# Altium schematic sheet MCU.SchDoc
size A4
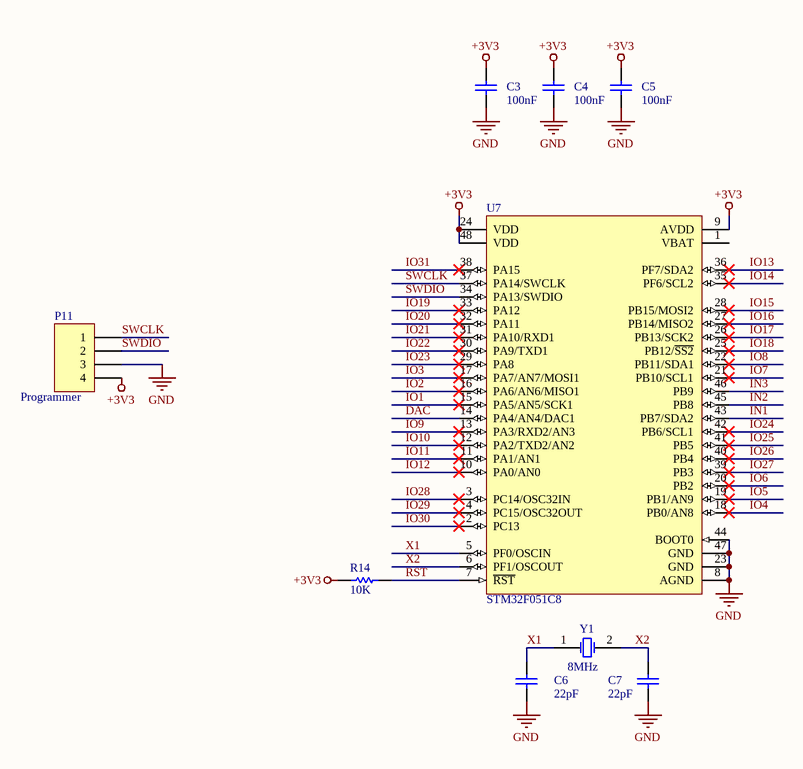
[diagram p0: MCU.SchDoc]

## Parts
C3  value 100nF  [C-0805]  (hidden comment: 104)
C4  value 100nF  [C-0805]  (hidden comment: 104)
C5  value 100nF  [C-0805]  (hidden comment: 104)
C6  value 22pF  [C-0805]  (hidden comment: 22)
C7  value 22pF  [C-0805]  (hidden comment: 22)
P11  value Programmer  [JP2.54-M-1x04A]  (hidden comment: JP2.54-M-4P)
R14  10K  [R-0805]
U7  STM32F051C8  [LQFP-48]
Y1  8MHz  [XTAL-49S]

## Nets
+3V3: C3.1 C4.1 C5.1 P11.4 R14.2 U7.9(AVDD) U7.24(VDD) U7.48(VDD)
GND: C3.2 C4.2 C5.2 C6.1 C7.1 P11.3 U7.8(AGND) U7.23(GND) U7.44(BOOT0) U7.47(GND)
DAC: U7.14(PA4/AN4/DAC1)
IN1: U7.43(PB7/SDA2)
IN2: U7.45(PB8)
IN3: U7.46(PB9)
IO1: U7.15(PA5/AN5/SCK1)
IO2: U7.16(PA6/AN6/MISO1)
IO3: U7.17(PA7/AN7/MOSI1)
IO4: U7.18(PB0/AN8)
IO5: U7.19(PB1/AN9)
IO6: U7.20(PB2)
IO7: U7.21(PB10/SCL1)
IO8: U7.22(PB11/SDA1)
IO9: U7.13(PA3/RXD2/AN3)
IO10: U7.12(PA2/TXD2/AN2)
IO11: U7.11(PA1/AN1)
IO12: U7.10(PA0/AN0)
IO13: U7.36(PF7/SDA2)
IO14: U7.35(PF6/SCL2)
IO15: U7.28(PB15/MOSI2)
IO16: U7.27(PB14/MISO2)
IO17: U7.26(PB13/SCK2)
IO18: U7.25(PB12/~{SS2})
IO19: U7.33(PA12)
IO20: U7.32(PA11)
IO21: U7.31(PA10/RXD1)
IO22: U7.30(PA9/TXD1)
IO23: U7.29(PA8)
IO24: U7.42(PB6/SCL1)
IO25: U7.41(PB5)
IO26: U7.40(PB4)
IO27: U7.39(PB3)
IO28: U7.3(PC14/OSC32IN)
IO29: U7.4(PC15/OSC32OUT)
IO30: U7.2(PC13)
IO31: U7.38(PA15)
RST: R14.1 U7.7(~{RST})
SWCLK: P11.1 U7.37(PA14/SWCLK)
SWDIO: P11.2 U7.34(PA13/SWDIO)
X1: C6.2 U7.5(PF0/OSCIN) Y1.1(OSC1)
X2: C7.2 U7.6(PF1/OSCOUT) Y1.2(OSC2)

Not connected (* = marked no-connect by the designer): U7 1(VBAT)

## Library data of the parts
C3-C7 = Cap: Capacitor; Published: 8-Jun-2000; LatestRevisionDate: 17-Jul-2002; LatestRevisionNote: Re-released for DXP Platform.; PackageReference: RAD-0.3; Publisher: Altium Limited
  C6 C7: PackageDescription: Radial Cap, Thru-Hole; 2 Leads; 0.3 in Pin Spacing
P11 = Header 4: Header, 4-Pin; LatestRevisionDate: 17-Jul-2002; LatestRevisionNote: Re-released for DXP Platform.
R14 = Res1: Resistor; Published: 8-Jun-2000; LatestRevisionDate: 17-Jul-2002; LatestRevisionNote: Re-released for DXP Platform.; PackageReference: AXIAL-0.3; Publisher: Altium Limited; PackageDescription: Axial Device, Thru-Hole; 2 Leads; 0.3 in Pin Spacing; Value: 10K
U7 = STM32F051C8: Core: ARM® 32-bit Cortex® -M0 CPU, frequency up to 48 MHz; Value: STM32F051C8
Y1 = XTAL: Crystal Oscillator; Published: 8-Jun-2000; LatestRevisionDate: 17-Jul-2002; LatestRevisionNote: Re-released for DXP Platform.; PackageReference: R38; Value: 8MHz; PackageDescription: Crystal, Thru-Hole; 2 Leads; Body 3.1 x 8.2 mm (Dia.xH)